# EAGLE schematic Minsys8051V3 (EAGLE 7.2.0)
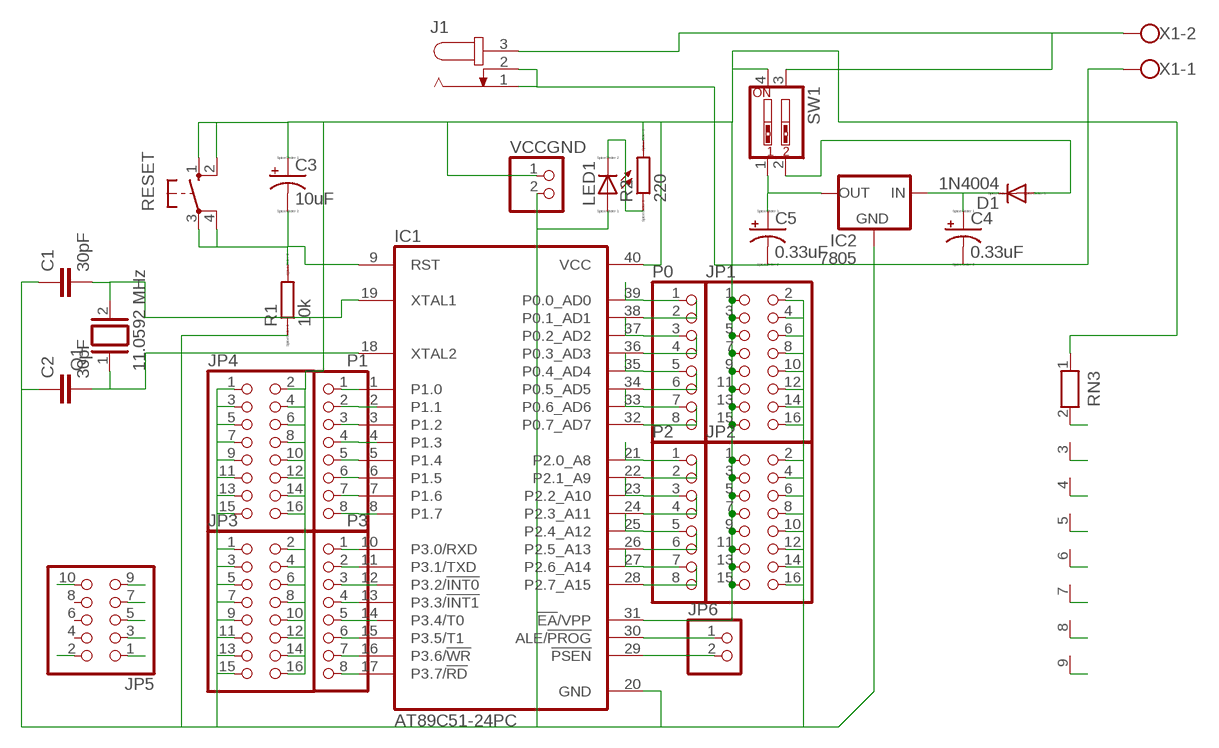
[diagram p0: schematic, sheet 1]

## Parts
C1  30pF  C-EU025-025X050  [C025-025X050]
C2  30pF  C-EU025-025X050  [C025-025X050]
C3  10uF  CPOL-USTT6D6  [TT5D6]
C4  0.33uF  CPOL-USTT6D6  [TT5D6]
C5  0.33uF  CPOL-USTT6D6  [TT5D6]
D1  1N4004  [DO41-10]
IC1  AT89C51-24PC  [DIL40]
IC2  7805  78XXS  [78XXS]
J1  JACK-PLUG1  [SPC4078]
JP1  PINHD-2X8  [2X08]
JP2  PINHD-2X8  [2X08]
JP3  PINHD-2X8  [2X08]
JP4  PINHD-2X8  [2X08]
JP5  PINHD-2X5  [2X05]
JP6  PINHD-1X2  [1X02]
LED1  LED_ELD260  [LED_LD260]
P0  PINHD-1X8  [1X08]
P1  PINHD-1X8  [1X08]
P2  PINHD-1X8  [1X08]
P3  PINHD-1X8  [1X08]
Q1  11.0592 MHz  XTAL/S  [QS]
R1  10k  R0207/10  [0207/10]
R2  220  R0207/10  [0207/10]
RESET  10-XX  [B3F-10XX]
RN3  RN08  [RN-9]
SW1  SW_DIP-2  [EDG-02]
VCCGND  PINHD-1X2  [1X02]
X1  W237-102  [W237-102]

## Nets
GND: C1.1 C2.1 C4.- C5.- IC1.20(GND) IC2.GND J1.1 J1.2 JP1.2 JP1.4 JP1.6 JP1.8 JP1.10 JP1.12 JP1.14 JP1.16 JP2.2 JP2.4 JP2.6 JP2.8 JP2.10 JP2.12 JP2.14 JP2.16 JP3.1 JP3.3 JP3.5 JP3.7 JP3.9 JP3.11 JP3.13 JP3.15 JP4.1 JP4.3 JP4.5 JP4.7 JP4.9 JP4.11 JP4.13 JP4.15 JP5.2 LED1.A R1.1 VCCGND.2 X1.1
MISO: IC1.7(P1.6) JP5.1 P1.7
MOSI: IC1.6(P1.5) JP5.9 P1.6
N$1: IC1.30(ALE/!PROG) JP6.1
N$2: LED1.K(C) R2.1
N$3: C1.2 IC1.19(XTAL1) Q1.2
N$4: C2.2 IC1.18(XTAL2) Q1.1
N$5: IC1.29(!PSEN) JP6.2
N$7: J1.3 SW1.3 X1.2
N$8: D1.A SW1.2
N$10: C5.+ IC2.OUT SW1.1
N$12: JP5.7
N$38: C4.+ D1.C IC2.IN
P00: IC1.39(P0.0_AD0) P0.1 RN3.2
P01: IC1.38(P0.1_AD1) P0.2 RN3.3
P02: IC1.37(P0.2_AD2) P0.3 RN3.4
P03: IC1.36(P0.3_AD3) P0.4 RN3.5
P04: IC1.35(P0.4_AD4) P0.5 RN3.6
P05: IC1.34(P0.5_AD5) P0.6 RN3.7
P06: IC1.33(P0.6_AD6) P0.7 RN3.8
P07: IC1.32(P0.7_AD7) P0.8 RN3.9
P10: IC1.1(P1.0) P1.1
P11: IC1.2(P1.1) P1.2
P12: IC1.3(P1.2) P1.3
P13: IC1.4(P1.3) P1.4
P14: IC1.5(P1.4) P1.5
P20: IC1.21(P2.0_A8) P2.1
P21: IC1.22(P2.1_A9) P2.2
P22: IC1.23(P2.2_A10) P2.3
P23: IC1.24(P2.3_A11) P2.4
P24: IC1.25(P2.4_A12) P2.5
P25: IC1.26(P2.5_A13) P2.6
P26: IC1.27(P2.6_A14) P2.7
P27: IC1.28(P2.7_A15) P2.8
P30: IC1.10(P3.0/RXD) P3.1
P31: IC1.11(P3.1/TXD) P3.2
P32: IC1.12(P3.2/!INT0) P3.3
P33: IC1.13(P3.3/!INT1) P3.4
P34: IC1.14(P3.4/T0) P3.5
P35: IC1.15(P3.5/T1) P3.6
P36: IC1.16(P3.6/!WR) P3.7
P37: IC1.17(P3.7/!RD) P3.8
RST: C3.- IC1.9(RST) JP5.5 R1.2 RESET.3(P) RESET.4(P1)
SCK: IC1.8(P1.7) JP5.3 P1.8
VCC: C3.+ IC1.31(!EA!/VPP) IC1.40(VCC) JP1.1 JP1.3 JP1.5 JP1.7 JP1.9 JP1.11 JP1.13 JP1.15 JP2.1 JP2.3 JP2.5 JP2.7 JP2.9 JP2.11 JP2.13 JP2.15 JP3.2 JP3.4 JP3.6 JP3.8 JP3.10 JP3.12 JP3.14 JP3.16 JP4.2 JP4.4 JP4.6 JP4.8 JP4.10 JP4.12 JP4.14 JP4.16 JP5.10 R2.2 RESET.1(S) RESET.2(S1) RN3.1 SW1.4 VCCGND.1
Unconnected: JP5.4 JP5.6 JP5.8

## Library data of the parts
C1 C2 = resistor:C-EU: CAPACITOR, European symbol
C3-C5 = resistor:CPOL-US: POLARIZED CAPACITOR, American symbol
D1 = diode:1N4004: DIODE general purpose rectifier, 1 A
IC1 = atmel:AT89C51-*: 8-bit Microcontroller with 4K Bytes Flash Not Recommended for New Designs. Use AT89S51. Source: http://www.atmel.com/dyn/resources/prod_documents/doc0265.; OC_FARNELL: unknown; OC_NEWARK: unknown
IC2 = v-reg:78XXS: VOLTAGE REGULATOR
J1 = con-jack:JACK-PLUG: DC POWER JACK Power Jack, DC, Right Angle, Through Hole, Rated 5A at 16VDC, PC Terminals Distributor: Farnell (www.Farnell.de) Drawing: 84N1161.pdf / 84N1162.pdf Manufacturer: SPC Technology (www.spctechnology.com) Type: SPC4077 / SPC 4078; OC_FARNELL: unknown; OC_NEWARK: unknown
JP1-JP4 = pinhead:PINHD-2X8: PIN HEADER
JP5 = pinhead:PINHD-2X5: PIN HEADER
JP6 VCCGND = pinhead:PINHD-1X2: PIN HEADER
LED1 = eagle-ltspice:LED_E: LED Source: http://www.osram.convergy.de Source: www.luxeon.com Source: www.kingbright.com; SPICEMODEL: NONE; SPICEPREFIX: D; SPICETYPE: diode
P0 P1-P3 = pinhead:PINHD-1X8: PIN HEADER
Q1 = special:XTAL/S: CRYSTAL
R1 R2 = eagle-ltspice:R: RESISTOR, European symbol; SPICEMODEL: NONE; SPICEPREFIX: R
RESET = switch-omron:10-XX: OMRON SWITCH; MPN: B3F-1000; OC_FARNELL: 176432; OC_NEWARK: 36M3542
RN3 = resistor-net:RN08: RESISTOR NETWORK; OC_FARNELL: unknown; OC_NEWARK: unknown
SW1 = special:SW_DIP-2: DIP SWITCH
X1 = con-wago-500:W237-102: WAGO SCREW CLAMP; MPN: 237-102; OC_FARNELL: unknown; OC_NEWARK: 70K9898